# EAGLE schematic CPU (EAGLE 7.5.0), part 4 of 7
## Module MOV16
Ports: I1(in) I2(in) I3(in) I4(in) I5(in) I6(in) I8(in) I7(in) T1(in) T2(in) T3(in) T4(in) T5(in) T6(in) T7(in) T8(in) VCC(in) GND(in) SELECT_M_TO_ADDRESSBUS(out) SELECT_X_TO_ADDRESSBUS(out) SELECT_J_TO_ADDRESSBUS(out) SELECT_SP_TO_ADDRESSBUS(out) SELECT_BP_TO_ADDRESSBUS(out) SELECT_Y_TO_ADDRESSBUS(out) SELECT_Z_TO_ADDRESSBUS(out) LOAD_M_FROM_ADDRESSBUS(out) LOAD_X_FROM_ADDRESSBUS(out) LOAD_J_FROM_ADDRESSBUS(out) LOAD_SP_FROM_ADDRESSBUS(out) LOAD_BP_FROM_ADDRESSBUS(out) LOAD_Y_FROM_ADDRESSBUS(out) LOAD_Z_FROM_ADDRESSBUS(out)
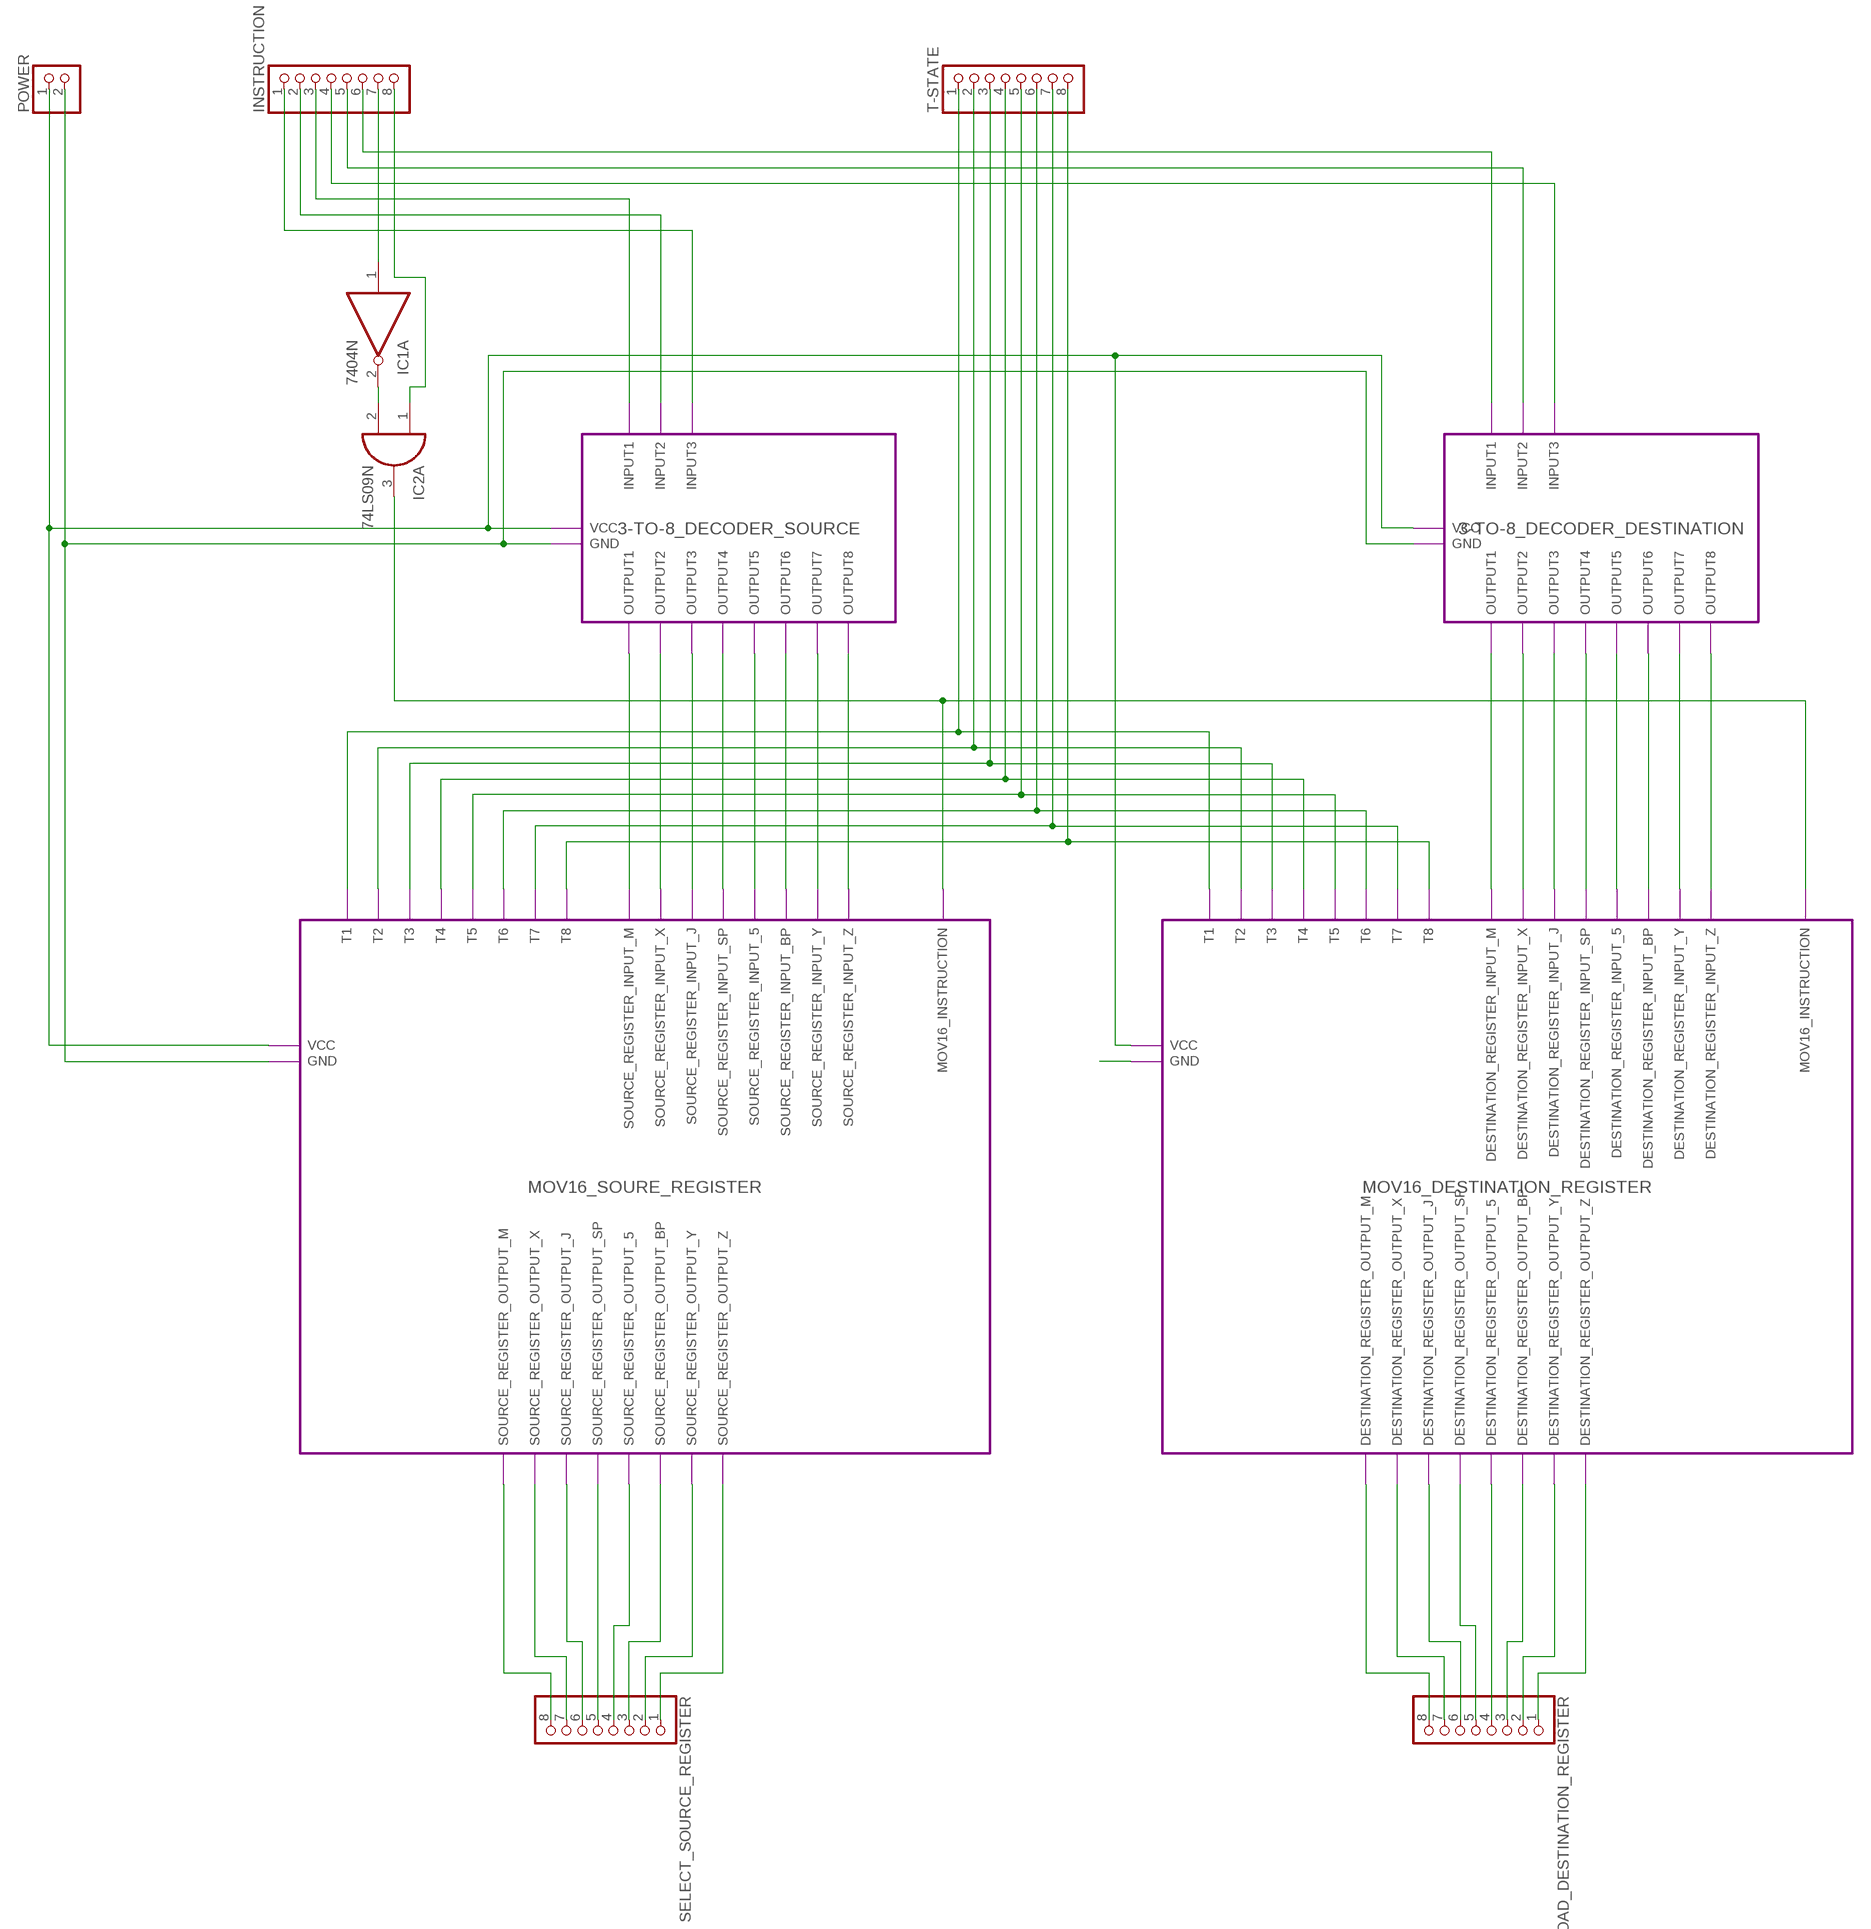
[diagram p58: schematic, module MOV16, sheet 1]

### Parts
IC1  7404N  [DIL14]
IC2  74LS09N  [DIL14]
INSTRUCTION  PINHD-1X8  [1X08]
LOAD_DESTINATION_REGISTER  PINHD-1X8  [1X08]
POWER  PINHD-1X2  [1X02]
SELECT_SOURCE_REGISTER  PINHD-1X8  [1X08]
T-STATE  PINHD-1X8  [1X08]

### Module instances
3-TO-8_DECODER_SOURCE = 3-TO-8_DECODER
3-TO-8_DECODER_DESTINATION = 3-TO-8_DECODER
MOV16_SOURE_REGISTER = MOV16_SOURE_REGISTER
MOV16_DESTINATION_REGISTER = MOV16_DESTINATION_REGISTER

### Nets
GND: POWER.2 ; port 3-TO-8_DECODER_SOURCE.GND 3-TO-8_DECODER_DESTINATION.GND MOV16_SOURE_REGISTER.GND
I1: INSTRUCTION.1 ; port 3-TO-8_DECODER_SOURCE.INPUT3
I2: INSTRUCTION.2 ; port 3-TO-8_DECODER_SOURCE.INPUT2
I3: INSTRUCTION.3 ; port 3-TO-8_DECODER_SOURCE.INPUT1
I4: INSTRUCTION.4 ; port 3-TO-8_DECODER_DESTINATION.INPUT3
I5: INSTRUCTION.5 ; port 3-TO-8_DECODER_DESTINATION.INPUT2
I6: INSTRUCTION.6 ; port 3-TO-8_DECODER_DESTINATION.INPUT1
I7: IC1.1(A:I) INSTRUCTION.7
I8: IC2.1(A:I0) INSTRUCTION.8
LOAD_5_FROM_ADDRESSBUS: LOAD_DESTINATION_REGISTER.4 ; port MOV16_DESTINATION_REGISTER.DESTINATION_REGISTER_OUTPUT_5
LOAD_BP_FROM_ADDRESSBUS: LOAD_DESTINATION_REGISTER.3 ; port MOV16_DESTINATION_REGISTER.DESTINATION_REGISTER_OUTPUT_BP
LOAD_J_FROM_ADDRESSBUS: LOAD_DESTINATION_REGISTER.6 ; port MOV16_DESTINATION_REGISTER.DESTINATION_REGISTER_OUTPUT_J
LOAD_M_FROM_ADDRESSBUS: LOAD_DESTINATION_REGISTER.8 ; port MOV16_DESTINATION_REGISTER.DESTINATION_REGISTER_OUTPUT_M
LOAD_SP_FROM_ADDRESSBUS: LOAD_DESTINATION_REGISTER.5 ; port MOV16_DESTINATION_REGISTER.DESTINATION_REGISTER_OUTPUT_SP
LOAD_X_FROM_ADDRESSBUS: LOAD_DESTINATION_REGISTER.7 ; port MOV16_DESTINATION_REGISTER.DESTINATION_REGISTER_OUTPUT_X
LOAD_Y_FROM_ADDRESSBUS: LOAD_DESTINATION_REGISTER.2 ; port MOV16_DESTINATION_REGISTER.DESTINATION_REGISTER_OUTPUT_Y
LOAD_Z_FROM_ADDRESSBUS: LOAD_DESTINATION_REGISTER.1 ; port MOV16_DESTINATION_REGISTER.DESTINATION_REGISTER_OUTPUT_Z
N$3: IC1.2(A:O) IC2.2(A:I1)
N$6: port MOV16_DESTINATION_REGISTER.GND
N$10: IC2.3(A:O) ; port MOV16_DESTINATION_REGISTER.MOV16_INSTRUCTION MOV16_SOURE_REGISTER.MOV16_INSTRUCTION
N$11: port 3-TO-8_DECODER_SOURCE.OUTPUT1 MOV16_SOURE_REGISTER.SOURCE_REGISTER_INPUT_M
N$12: port MOV16_SOURE_REGISTER.SOURCE_REGISTER_INPUT_X 3-TO-8_DECODER_SOURCE.OUTPUT2
N$13: port 3-TO-8_DECODER_SOURCE.OUTPUT3 MOV16_SOURE_REGISTER.SOURCE_REGISTER_INPUT_J
N$14: port MOV16_SOURE_REGISTER.SOURCE_REGISTER_INPUT_SP 3-TO-8_DECODER_SOURCE.OUTPUT4
N$15: port 3-TO-8_DECODER_SOURCE.OUTPUT5 MOV16_SOURE_REGISTER.SOURCE_REGISTER_INPUT_5
N$16: port MOV16_SOURE_REGISTER.SOURCE_REGISTER_INPUT_BP 3-TO-8_DECODER_SOURCE.OUTPUT6
N$17: port 3-TO-8_DECODER_SOURCE.OUTPUT7 MOV16_SOURE_REGISTER.SOURCE_REGISTER_INPUT_Y
N$18: port MOV16_SOURE_REGISTER.SOURCE_REGISTER_INPUT_Z 3-TO-8_DECODER_SOURCE.OUTPUT8
N$19: port MOV16_DESTINATION_REGISTER.DESTINATION_REGISTER_INPUT_M 3-TO-8_DECODER_DESTINATION.OUTPUT1
N$20: port 3-TO-8_DECODER_DESTINATION.OUTPUT2 MOV16_DESTINATION_REGISTER.DESTINATION_REGISTER_INPUT_X
N$21: port MOV16_DESTINATION_REGISTER.DESTINATION_REGISTER_INPUT_J 3-TO-8_DECODER_DESTINATION.OUTPUT3
N$22: port 3-TO-8_DECODER_DESTINATION.OUTPUT4 MOV16_DESTINATION_REGISTER.DESTINATION_REGISTER_INPUT_SP
N$23: port MOV16_DESTINATION_REGISTER.DESTINATION_REGISTER_INPUT_5 3-TO-8_DECODER_DESTINATION.OUTPUT5
N$24: port 3-TO-8_DECODER_DESTINATION.OUTPUT6 MOV16_DESTINATION_REGISTER.DESTINATION_REGISTER_INPUT_BP
N$25: port MOV16_DESTINATION_REGISTER.DESTINATION_REGISTER_INPUT_Y 3-TO-8_DECODER_DESTINATION.OUTPUT7
N$26: port 3-TO-8_DECODER_DESTINATION.OUTPUT8 MOV16_DESTINATION_REGISTER.DESTINATION_REGISTER_INPUT_Z
SELECT_5_TO_ADDRESSBUS: SELECT_SOURCE_REGISTER.4 ; port MOV16_SOURE_REGISTER.SOURCE_REGISTER_OUTPUT_5
SELECT_BP_TO_ADDRESSBUS: SELECT_SOURCE_REGISTER.3 ; port MOV16_SOURE_REGISTER.SOURCE_REGISTER_OUTPUT_BP
SELECT_J_TO_ADDRESSBUS: SELECT_SOURCE_REGISTER.6 ; port MOV16_SOURE_REGISTER.SOURCE_REGISTER_OUTPUT_J
SELECT_M_TO_ADDRESSBUS: SELECT_SOURCE_REGISTER.8 ; port MOV16_SOURE_REGISTER.SOURCE_REGISTER_OUTPUT_M
SELECT_SP_TO_ADDRESSBUS: SELECT_SOURCE_REGISTER.5 ; port MOV16_SOURE_REGISTER.SOURCE_REGISTER_OUTPUT_SP
SELECT_X_TO_ADDRESSBUS: SELECT_SOURCE_REGISTER.7 ; port MOV16_SOURE_REGISTER.SOURCE_REGISTER_OUTPUT_X
SELECT_Y_TO_ADDRESSBUS: SELECT_SOURCE_REGISTER.2 ; port MOV16_SOURE_REGISTER.SOURCE_REGISTER_OUTPUT_Y
SELECT_Z_TO_ADDRESSBUS: SELECT_SOURCE_REGISTER.1 ; port MOV16_SOURE_REGISTER.SOURCE_REGISTER_OUTPUT_Z
T1: T-STATE.1 ; port MOV16_DESTINATION_REGISTER.T1 MOV16_SOURE_REGISTER.T1
T2: T-STATE.2 ; port MOV16_SOURE_REGISTER.T2 MOV16_DESTINATION_REGISTER.T2
T3: T-STATE.3 ; port MOV16_SOURE_REGISTER.T3 MOV16_DESTINATION_REGISTER.T3
T4: T-STATE.4 ; port MOV16_SOURE_REGISTER.T4 MOV16_DESTINATION_REGISTER.T4
T5: T-STATE.5 ; port MOV16_SOURE_REGISTER.T5 MOV16_DESTINATION_REGISTER.T5
T6: T-STATE.6 ; port MOV16_SOURE_REGISTER.T6 MOV16_DESTINATION_REGISTER.T6
T7: T-STATE.7 ; port MOV16_SOURE_REGISTER.T7 MOV16_DESTINATION_REGISTER.T7
T8: T-STATE.8 ; port MOV16_DESTINATION_REGISTER.T8 MOV16_SOURE_REGISTER.T8
VCC: POWER.1 ; port 3-TO-8_DECODER_SOURCE.VCC 3-TO-8_DECODER_DESTINATION.VCC MOV16_SOURE_REGISTER.VCC MOV16_DESTINATION_REGISTER.VCC
Unconnected: IC1.3(B:I) IC1.4(B:O) IC1.5(C:I) IC1.6(C:O) IC1.8(D:O) IC1.9(D:I) IC1.10(E:O) IC1.11(E:I) IC1.12(F:O) IC1.13(F:I) IC2.4(B:I0) IC2.5(B:I1) IC2.6(B:O) IC2.8(C:O) IC2.9(C:I0) IC2.10(C:I1) IC2.11(D:O) IC2.12(D:I0) IC2.13(D:I1)

### Power pins joined to a net without a drawn wire
GND: IC1.7(P:GND) IC2.7(P:GND)
VCC: IC1.14(P:VCC) IC2.14(P:VCC)

### Library data of the parts
IC1 = 74xx-eu:74*04: Hex INVERTER
IC2 = 74xx-eu:74*09: Quad 2-input AND gate, open collector
INSTRUCTION LOAD_DESTINATION_REGISTER SELECT_SOURCE_REGISTER T-STATE = pinhead:PINHD-1X8: PIN HEADER
POWER = pinhead:PINHD-1X2: PIN HEADER

## Module JMP
Ports: I1(in) I2(in) I3(in) I4(in) I5(in) I6(in) I7(in) I8(in) T1(in) T2(in) T3(in) T4(in) T5(in) T6(in) T7(in) T8(in) VCC(in) GND(in) SELECT_J_TO_ADDRESSBUS(out) LOAD_PC(out)
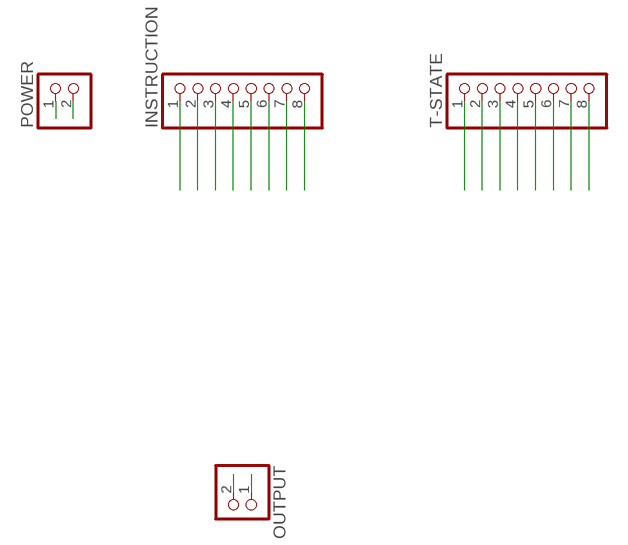
[diagram p59: schematic, module JMP, sheet 1]

### Parts
INSTRUCTION  PINHD-1X8  [1X08]
OUTPUT  PINHD-1X2  [1X02]
POWER  PINHD-1X2  [1X02]
T-STATE  PINHD-1X8  [1X08]

### Nets
GND: POWER.2
I1: INSTRUCTION.1
I2: INSTRUCTION.2
I3: INSTRUCTION.3
I4: INSTRUCTION.4
I5: INSTRUCTION.5
I6: INSTRUCTION.6
I7: INSTRUCTION.7
I8: INSTRUCTION.8
LOAD_PC: OUTPUT.2
SELECT_J_TO_ADDRESSBUS: OUTPUT.1
T1: T-STATE.1
T2: T-STATE.2
T3: T-STATE.3
T4: T-STATE.4
T5: T-STATE.5
T6: T-STATE.6
T7: T-STATE.7
T8: T-STATE.8
VCC: POWER.1

### Library data of the parts
INSTRUCTION T-STATE = pinhead:PINHD-1X8: PIN HEADER
OUTPUT POWER = pinhead:PINHD-1X2: PIN HEADER

## Module MOV
Ports: I1(in) I2(in) I3(in) I4(in) I5(in) I6(in) I7(in) I8(in) T1(in) T2(in) T3(in) T4(in) T5(in) T6(in) T7(in) T8(in) VCC(in) GND(in) SELECT_D_TO_DATABUS(out) SELECT_E_TO_DATABUS(out) SELECT_F_TO_DATABUS(out) SELECT_G_TO_DATABUS(out) SELECT_H_TO_DATABUS(out) SELECT_XL_TO_DATABUS(out) SELECT_XH_TO_DATABUS(out) SELECT_XE_TO_DATABUS(out) LOAD_D_FROM_DATABUS(out) LOAD_E_FROM_DATABUS(out) LOAD_F_FROM_DATABUS(out) LOAD_G_FROM_DATABUS(out) LOAD_H_FROM_DATABUS(out) LOAD_XL_FROM_DATABUS(out) LOAD_XH_FROM_DATABUS(out) LOAD_XE_FROM_DATABUS(out)
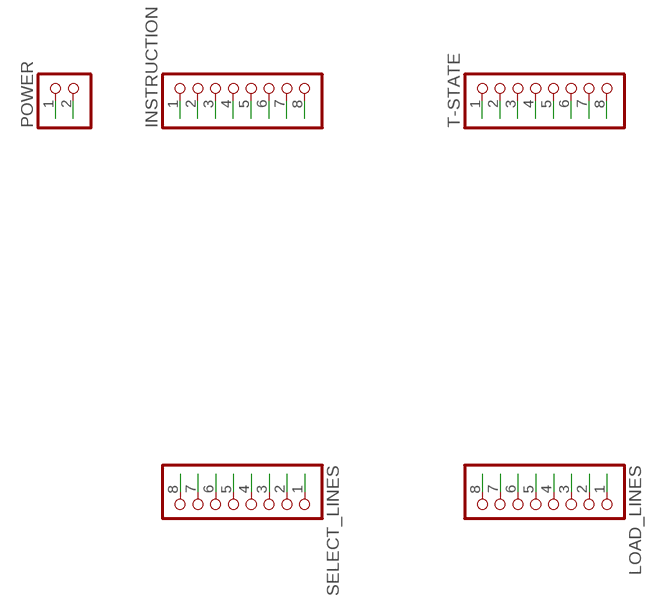
[diagram p60: schematic, module MOV, sheet 1]

### Parts
INSTRUCTION  PINHD-1X8  [1X08]
LOAD_LINES  PINHD-1X8  [1X08]
POWER  PINHD-1X2  [1X02]
SELECT_LINES  PINHD-1X8  [1X08]
T-STATE  PINHD-1X8  [1X08]

### Nets
GND: POWER.2
I1: INSTRUCTION.1
I2: INSTRUCTION.2
I3: INSTRUCTION.3
I4: INSTRUCTION.4
I5: INSTRUCTION.5
I6: INSTRUCTION.6
I7: INSTRUCTION.7
I8: INSTRUCTION.8
LOAD_D_FROM_DATABUS: LOAD_LINES.8
LOAD_E_FROM_DATABUS: LOAD_LINES.7
LOAD_F_FROM_DATABUS: LOAD_LINES.6
LOAD_G_FROM_DATABUS: LOAD_LINES.5
LOAD_H_FROM_DATABUS: LOAD_LINES.4
LOAD_XE_FROM_DATABUS: LOAD_LINES.1
LOAD_XH_FROM_DATABUS: LOAD_LINES.2
LOAD_XL_FROM_DATABUS: LOAD_LINES.3
SELECT_D_TO_DATABUS: SELECT_LINES.8
SELECT_E_TO_DATABUS: SELECT_LINES.7
SELECT_F_TO_DATABUS: SELECT_LINES.6
SELECT_G_TO_DATABUS: SELECT_LINES.5
SELECT_H_TO_DATABUS: SELECT_LINES.4
SELECT_XE_TO_DATABUS: SELECT_LINES.1
SELECT_XH_TO_DATABUS: SELECT_LINES.2
SELECT_XL_TO_DATABUS: SELECT_LINES.3
T1: T-STATE.1
T2: T-STATE.2
T3: T-STATE.3
T4: T-STATE.4
T5: T-STATE.5
T6: T-STATE.6
T7: T-STATE.7
T8: T-STATE.8
VCC: POWER.1

### Library data of the parts
INSTRUCTION LOAD_LINES SELECT_LINES T-STATE = pinhead:PINHD-1X8: PIN HEADER
POWER = pinhead:PINHD-1X2: PIN HEADER

## Module JZ
Ports: I1(in) I2(in) I3(in) I4(in) I5(in) I6(in) I7(in) I8(in) T1(in) T2(in) T3(in) T4(in) T5(in) T6(in) T7(in) T8(in) ZERO(in) VCC(in) GND(in) SELECT_FLAGS(out) SELECT_J_TO_ADDRESSBUS(out) LOAD_PC(out)
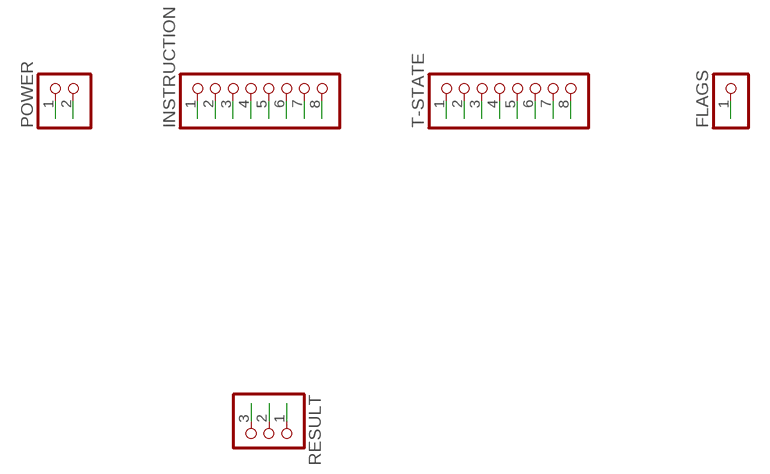
[diagram p61: schematic, module JZ, sheet 1]

### Parts
FLAGS  PINHD-1X1  [1X01]
INSTRUCTION  PINHD-1X8  [1X08]
POWER  PINHD-1X2  [1X02]
RESULT  PINHD-1X3  [1X03]
T-STATE  PINHD-1X8  [1X08]

### Nets
GND: POWER.2
I1: INSTRUCTION.1
I2: INSTRUCTION.2
I3: INSTRUCTION.3
I4: INSTRUCTION.4
I5: INSTRUCTION.5
I6: INSTRUCTION.6
I7: INSTRUCTION.7
I8: INSTRUCTION.8
LOAD_PC: RESULT.3
SELECT_FLAGS: RESULT.1
SELECT_J_TO_ADDRESSBUS: RESULT.2
T1: T-STATE.1
T2: T-STATE.2
T3: T-STATE.3
T4: T-STATE.4
T5: T-STATE.5
T6: T-STATE.6
T7: T-STATE.7
T8: T-STATE.8
VCC: POWER.1
ZERO: FLAGS.1

### Library data of the parts
FLAGS = pinhead:PINHD-1X1: PIN HEADER
INSTRUCTION T-STATE = pinhead:PINHD-1X8: PIN HEADER
POWER = pinhead:PINHD-1X2: PIN HEADER
RESULT = pinhead:PINHD-1X3: PIN HEADER

## Module JNS
Ports: I1(in) I2(in) I3(in) I4(in) I5(in) I6(in) I7(in) I8(in) T1(in) T2(in) T3(in) T4(in) T5(in) T6(in) T7(in) T8(in) SIGN(in) VCC(in) GND(in) SELECT_FLAGS(out) LOAD_PC(out) SELECT_J_TO_ADDRESSBUS(out)
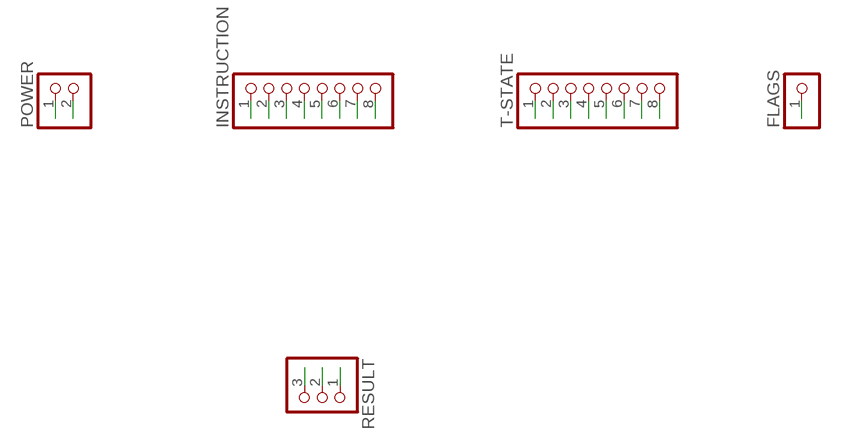
[diagram p62: schematic, module JNS, sheet 1]

### Parts
FLAGS  PINHD-1X1  [1X01]
INSTRUCTION  PINHD-1X8  [1X08]
POWER  PINHD-1X2  [1X02]
RESULT  PINHD-1X3  [1X03]
T-STATE  PINHD-1X8  [1X08]

### Nets
GND: POWER.2
I1: INSTRUCTION.1
I2: INSTRUCTION.2
I3: INSTRUCTION.3
I4: INSTRUCTION.4
I5: INSTRUCTION.5
I6: INSTRUCTION.6
I7: INSTRUCTION.7
I8: INSTRUCTION.8
LOAD_PC: RESULT.3
SELECT_FLAGS: RESULT.1
SELECT_J_TO_ADDRESSBUS: RESULT.2
SIGN: FLAGS.1
T1: T-STATE.1
T2: T-STATE.2
T3: T-STATE.3
T4: T-STATE.4
T5: T-STATE.5
T6: T-STATE.6
T7: T-STATE.7
T8: T-STATE.8
VCC: POWER.1

### Library data of the parts
FLAGS = pinhead:PINHD-1X1: PIN HEADER
INSTRUCTION T-STATE = pinhead:PINHD-1X8: PIN HEADER
POWER = pinhead:PINHD-1X2: PIN HEADER
RESULT = pinhead:PINHD-1X3: PIN HEADER

## Module JNC
Ports: I1(in) I2(in) I3(in) I4(in) I5(in) I6(in) I7(in) I8(in) T1(in) T2(in) T3(in) T4(in) T5(in) T6(in) T7(in) T8(in) VCC(in) GND(in) SELECT_FLAGS(out) LOAD_PC(out) SELECT_J_TO_ADDRESSBUS(out) CARRY(in)
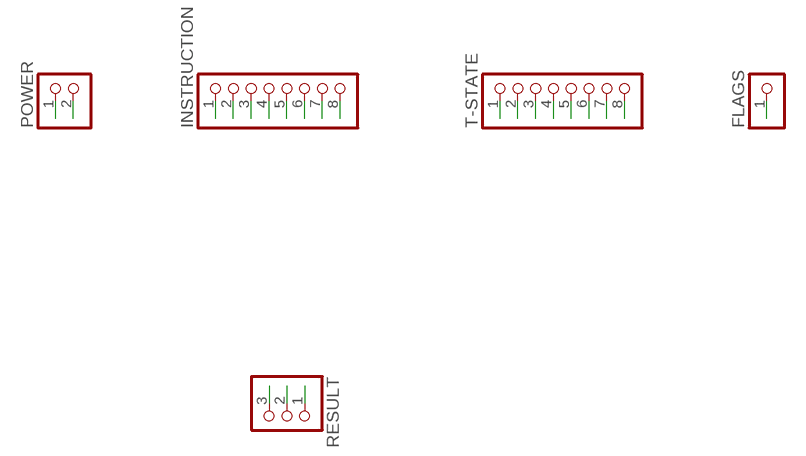
[diagram p63: schematic, module JNC, sheet 1]

### Parts
FLAGS  PINHD-1X1  [1X01]
INSTRUCTION  PINHD-1X8  [1X08]
POWER  PINHD-1X2  [1X02]
RESULT  PINHD-1X3  [1X03]
T-STATE  PINHD-1X8  [1X08]

### Nets
CARRY: FLAGS.1
GND: POWER.2
I1: INSTRUCTION.1
I2: INSTRUCTION.2
I3: INSTRUCTION.3
I4: INSTRUCTION.4
I5: INSTRUCTION.5
I6: INSTRUCTION.6
I7: INSTRUCTION.7
I8: INSTRUCTION.8
LOAD_PC: RESULT.3
SELECT_FLAGS: RESULT.1
SELECT_J_TO_ADDRESSBUS: RESULT.2
T1: T-STATE.1
T2: T-STATE.2
T3: T-STATE.3
T4: T-STATE.4
T5: T-STATE.5
T6: T-STATE.6
T7: T-STATE.7
T8: T-STATE.8
VCC: POWER.1

### Library data of the parts
FLAGS = pinhead:PINHD-1X1: PIN HEADER
INSTRUCTION T-STATE = pinhead:PINHD-1X8: PIN HEADER
POWER = pinhead:PINHD-1X2: PIN HEADER
RESULT = pinhead:PINHD-1X3: PIN HEADER

## Module JNZ
Ports: I1(in) I2(in) I3(in) I4(in) I5(in) I6(in) I7(in) I8(in) T1(in) T2(in) T3(in) T4(in) T5(in) T6(in) T7(in) T8(in) ZERO(in) VCC(in) GND(in) SELECT_FLAGS(out) LOAD_PC(out) SELECT_J_TO_ADDRESSBUS(out)
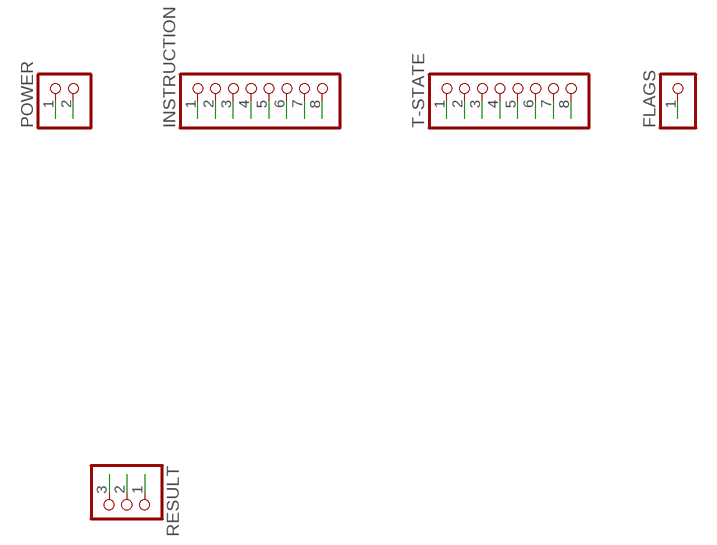
[diagram p64: schematic, module JNZ, sheet 1]

### Parts
FLAGS  PINHD-1X1  [1X01]
INSTRUCTION  PINHD-1X8  [1X08]
POWER  PINHD-1X2  [1X02]
RESULT  PINHD-1X3  [1X03]
T-STATE  PINHD-1X8  [1X08]

### Nets
GND: POWER.2
I1: INSTRUCTION.1
I2: INSTRUCTION.2
I3: INSTRUCTION.3
I4: INSTRUCTION.4
I5: INSTRUCTION.5
I6: INSTRUCTION.6
I7: INSTRUCTION.7
I8: INSTRUCTION.8
LOAD_PC: RESULT.3
SELECT_FLAGS: RESULT.1
SELECT_J_TO_ADDRESSBUS: RESULT.2
T1: T-STATE.1
T2: T-STATE.2
T3: T-STATE.3
T4: T-STATE.4
T5: T-STATE.5
T6: T-STATE.6
T7: T-STATE.7
T8: T-STATE.8
VCC: POWER.1
ZERO: FLAGS.1

### Library data of the parts
FLAGS = pinhead:PINHD-1X1: PIN HEADER
INSTRUCTION T-STATE = pinhead:PINHD-1X8: PIN HEADER
POWER = pinhead:PINHD-1X2: PIN HEADER
RESULT = pinhead:PINHD-1X3: PIN HEADER

## Module ADDER_16BIT
Ports: I1(in) I2(in) I3(in) I4(in) I5(in) I6(in) I7(in) I8(in) T1(in) T2(in) T3(in) T4(in) T5(in) T6(in) T7(in) T8(in) VCC(in) GND(in) SELECT_X_TO_ADDRESSBUS(out) LOAD_INPUT_A(out) SELECT_J_TO_ADDRESSBUS(out) LOAD_INPUT_B(out) SELECT_INPUT_A(out) SELECT_INPUT_B(out) LOAD_OUTPUT_C(out) SELECT_OUTPUT_C(out) LOAD_X_FROM_ADDRESSBUS(out)
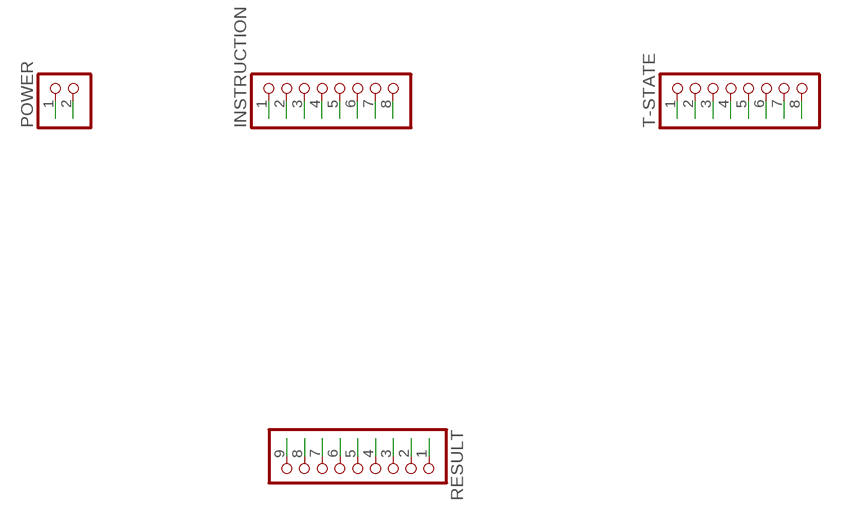
[diagram p65: schematic, module ADDER_16BIT, sheet 1]

### Parts
INSTRUCTION  PINHD-1X8  [1X08]
POWER  PINHD-1X2  [1X02]
RESULT  PINHD-1X9  [1X09]
T-STATE  PINHD-1X8  [1X08]

### Nets
GND: POWER.2
I1: INSTRUCTION.1
I2: INSTRUCTION.2
I3: INSTRUCTION.3
I4: INSTRUCTION.4
I5: INSTRUCTION.5
I6: INSTRUCTION.6
I7: INSTRUCTION.7
I8: INSTRUCTION.8
LOAD_INPUT_A: RESULT.2
LOAD_INPUT_B: RESULT.4
LOAD_OUTPUT_C: RESULT.7
LOAD_X_FROM_ADDRESSBUS: RESULT.9
SELECT_INPUT_A: RESULT.5
SELECT_INPUT_B: RESULT.6
SELECT_J_TO_ADDRESSBUS: RESULT.3
SELECT_OUTPUT_C: RESULT.8
SELECT_X_TO_ADDRESSBUS: RESULT.1
T1: T-STATE.1
T2: T-STATE.2
T3: T-STATE.3
T4: T-STATE.4
T5: T-STATE.5
T6: T-STATE.6
T7: T-STATE.7
T8: T-STATE.8
VCC: POWER.1

### Library data of the parts
INSTRUCTION T-STATE = pinhead:PINHD-1X8: PIN HEADER
POWER = pinhead:PINHD-1X2: PIN HEADER
RESULT = pinhead:PINHD-1X9: PIN HEADER

## Module IN
Ports: I1(in) I2(in) I3(in) I4(in) I5(in) I6(in) I7(in) I8(in) T1(in) T2(in) T3(in) T4(in) T5(in) T6(in) T7(in) T8(in) VCC(in) GND(in) SELECT_PORT_A_TO_DATABUS(out) SELECT_PORT_B_TO_DATABUS(out) LOAD_XL_FROM_DATABUS(out)
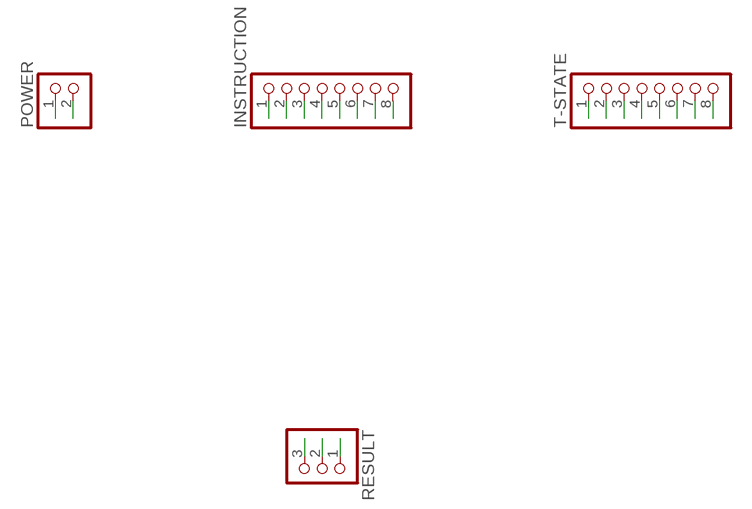
[diagram p66: schematic, module IN, sheet 1]

### Parts
INSTRUCTION  PINHD-1X8  [1X08]
POWER  PINHD-1X2  [1X02]
RESULT  PINHD-1X3  [1X03]
T-STATE  PINHD-1X8  [1X08]

### Nets
GND: POWER.2
I1: INSTRUCTION.1
I2: INSTRUCTION.2
I3: INSTRUCTION.3
I4: INSTRUCTION.4
I5: INSTRUCTION.5
I6: INSTRUCTION.6
I7: INSTRUCTION.7
I8: INSTRUCTION.8
LOAD_XL_FROM_DATABUS: RESULT.3
SELECT_PORT_A_TO_DATABUS: RESULT.1
SELECT_PORT_B_TO_DATABUS: RESULT.2
T1: T-STATE.1
T2: T-STATE.2
T3: T-STATE.3
T4: T-STATE.4
T5: T-STATE.5
T6: T-STATE.6
T7: T-STATE.7
T8: T-STATE.8
VCC: POWER.1

### Library data of the parts
INSTRUCTION T-STATE = pinhead:PINHD-1X8: PIN HEADER
POWER = pinhead:PINHD-1X2: PIN HEADER
RESULT = pinhead:PINHD-1X3: PIN HEADER

## Module OUT
Ports: I1(in) I2(in) I3(in) I4(in) I5(in) I6(in) I8(in) I7(in) T1(in) T2(in) T3(in) T4(in) T5(in) T6(in) T7(in) T8(in) VCC(in) GND(in) SELECT_XL_TO_DATABUS(out) LOAD_PORT_C_FROM_DATABUS(out) LOAD_PORT_D_FROM_DATABUS(out)
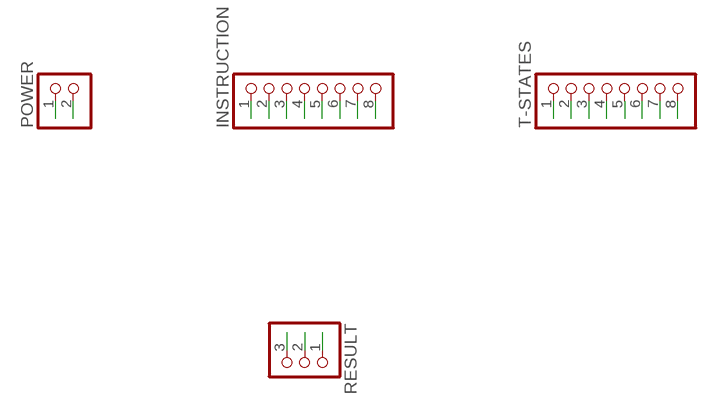
[diagram p67: schematic, module OUT, sheet 1]

### Parts
INSTRUCTION  PINHD-1X8  [1X08]
POWER  PINHD-1X2  [1X02]
RESULT  PINHD-1X3  [1X03]
T-STATES  PINHD-1X8  [1X08]

### Nets
GND: POWER.2
I1: INSTRUCTION.1
I2: INSTRUCTION.2
I3: INSTRUCTION.3
I4: INSTRUCTION.4
I5: INSTRUCTION.5
I6: INSTRUCTION.6
I7: INSTRUCTION.7
I8: INSTRUCTION.8
LOAD_PORT_C_FROM_DATABUS: RESULT.2
LOAD_PORT_D_FROM_DATABUS: RESULT.3
SELECT_XL_TO_DATABUS: RESULT.1
T1: T-STATES.1
T2: T-STATES.2
T3: T-STATES.3
T4: T-STATES.4
T5: T-STATES.5
T6: T-STATES.6
T7: T-STATES.7
T8: T-STATES.8
VCC: POWER.1

### Library data of the parts
INSTRUCTION T-STATES = pinhead:PINHD-1X8: PIN HEADER
POWER = pinhead:PINHD-1X2: PIN HEADER
RESULT = pinhead:PINHD-1X3: PIN HEADER

## Module SAVE_FLAGS
Ports: I1(in) I2(in) I3(in) I4(in) I5(in) I6(in) I7(in) I8(in) T1(in) T2(in) T3(in) T4(in) T5(in) T6(in) T7(in) T8(in) VCC(in) GND(in) SELECT_FLAGS(out) LOAD_FLAGSSAVED_FROM_FLAGSREGISTER(out)
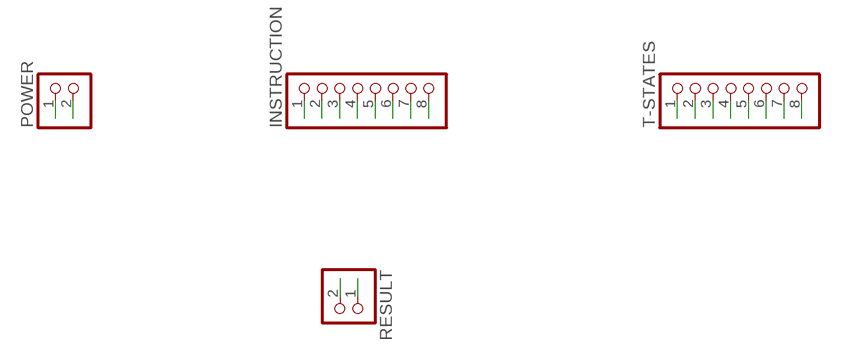
[diagram p68: schematic, module SAVE_FLAGS, sheet 1]

### Parts
INSTRUCTION  PINHD-1X8  [1X08]
POWER  PINHD-1X2  [1X02]
RESULT  PINHD-1X2  [1X02]
T-STATES  PINHD-1X8  [1X08]

### Nets
GND: POWER.2
I1: INSTRUCTION.1
I2: INSTRUCTION.2
I3: INSTRUCTION.3
I4: INSTRUCTION.4
I5: INSTRUCTION.5
I6: INSTRUCTION.6
I7: INSTRUCTION.7
I8: INSTRUCTION.8
LOAD_FLAGSSAVED_FROM_FLAGSREGISTER: RESULT.2
SELECT_FLAGS: RESULT.1
T1: T-STATES.1
T2: T-STATES.2
T3: T-STATES.3
T4: T-STATES.4
T5: T-STATES.5
T6: T-STATES.6
T7: T-STATES.7
T8: T-STATES.8
VCC: POWER.1

### Library data of the parts
INSTRUCTION T-STATES = pinhead:PINHD-1X8: PIN HEADER
POWER RESULT = pinhead:PINHD-1X2: PIN HEADER

## Module RESTORE_FLAGS
Ports: I1(in) I2(in) I3(in) I4(in) I5(in) I6(in) I7(in) I8(in) T1(in) T2(in) T3(in) T4(in) T5(in) T6(in) T7(in) T8(in) VCC(in) GND(in) LOAD_FLAGSSAVED_TO_FLAGSREGISTER(out) LOAD_FLAGS(out)
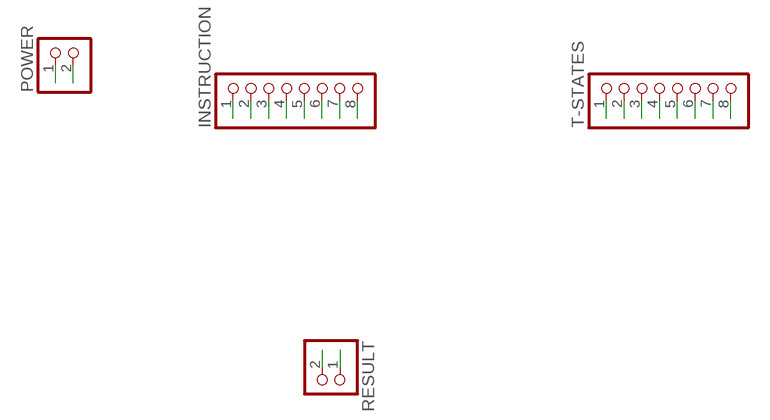
[diagram p69: schematic, module RESTORE_FLAGS, sheet 1]

### Parts
INSTRUCTION  PINHD-1X8  [1X08]
POWER  PINHD-1X2  [1X02]
RESULT  PINHD-1X2  [1X02]
T-STATES  PINHD-1X8  [1X08]

### Nets
GND: POWER.2
I1: INSTRUCTION.1
I2: INSTRUCTION.2
I3: INSTRUCTION.3
I4: INSTRUCTION.4
I5: INSTRUCTION.5
I6: INSTRUCTION.6
I7: INSTRUCTION.7
I8: INSTRUCTION.8
LOAD_FLAGS: RESULT.1
LOAD_FLAGSSAVED_TO_FLAGSREGISTER: RESULT.2
T1: T-STATES.1
T2: T-STATES.2
T3: T-STATES.3
T4: T-STATES.4
T5: T-STATES.5
T6: T-STATES.6
T7: T-STATES.7
T8: T-STATES.8
VCC: POWER.1

### Library data of the parts
INSTRUCTION T-STATES = pinhead:PINHD-1X8: PIN HEADER
POWER RESULT = pinhead:PINHD-1X2: PIN HEADER

## Module FLAGS_TO_OUTBUFFER
Ports: I1(in) I2(in) I3(in) I4(in) I5(in) I6(in) I7(in) I8(in) T1(in) T2(in) T3(in) T4(in) T5(in) T6(in) T7(in) T8(in) VCC(in) GND(in) LOAD_FLAGSFROMFLAGSBUS(out) SELECT_FLAGS_TO_OUTBUFFER(out)
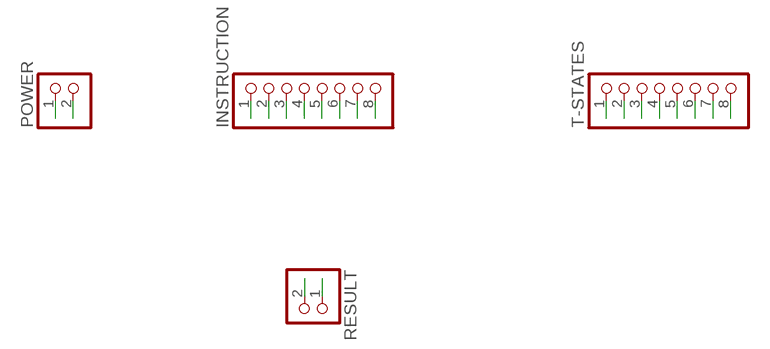
[diagram p70: schematic, module FLAGS_TO_OUTBUFFER, sheet 1]

### Parts
INSTRUCTION  PINHD-1X8  [1X08]
POWER  PINHD-1X2  [1X02]
RESULT  PINHD-1X2  [1X02]
T-STATES  PINHD-1X8  [1X08]

### Nets
GND: POWER.2
I1: INSTRUCTION.1
I2: INSTRUCTION.2
I3: INSTRUCTION.3
I4: INSTRUCTION.4
I5: INSTRUCTION.5
I6: INSTRUCTION.6
I7: INSTRUCTION.7
I8: INSTRUCTION.8
LOAD_FLAGSFROMFLAGSBUS: RESULT.2
SELECT_FLAGS_TO_OUTBUFFER: RESULT.1
T1: T-STATES.1
T2: T-STATES.2
T3: T-STATES.3
T4: T-STATES.4
T5: T-STATES.5
T6: T-STATES.6
T7: T-STATES.7
T8: T-STATES.8
VCC: POWER.1

### Library data of the parts
INSTRUCTION T-STATES = pinhead:PINHD-1X8: PIN HEADER
POWER RESULT = pinhead:PINHD-1X2: PIN HEADER

## Module INBUFFER_TO_FLAGS
Ports: I1(in) I2(in) I3(in) I4(in) I5(in) I6(in) I7(in) I8(in) T1(in) T2(in) T3(in) T4(in) T5(in) T6(in) T7(in) T8(in) VCC(in) GND(in) LOAD_FLAGS_INBUFFER_TO_FLAGS(out) SELECT_FLAGSTOFLAGSBUS(out)
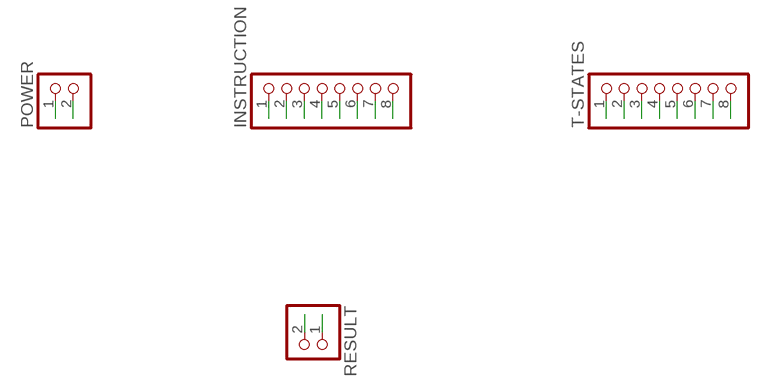
[diagram p71: schematic, module INBUFFER_TO_FLAGS, sheet 1]

### Parts
INSTRUCTION  PINHD-1X8  [1X08]
POWER  PINHD-1X2  [1X02]
RESULT  PINHD-1X2  [1X02]
T-STATES  PINHD-1X8  [1X08]

### Nets
GND: POWER.2
I1: INSTRUCTION.1
I2: INSTRUCTION.2
I3: INSTRUCTION.3
I4: INSTRUCTION.4
I5: INSTRUCTION.5
I6: INSTRUCTION.6
I7: INSTRUCTION.7
I8: INSTRUCTION.8
LOAD_FLAGS_INBUFFER_TO_FLAGS: RESULT.2
SELECT_FLAGSTOFLAGSBUS: RESULT.1
T1: T-STATES.1
T2: T-STATES.2
T3: T-STATES.3
T4: T-STATES.4
T5: T-STATES.5
T6: T-STATES.6
T7: T-STATES.7
T8: T-STATES.8
VCC: POWER.1

### Library data of the parts
INSTRUCTION T-STATES = pinhead:PINHD-1X8: PIN HEADER
POWER RESULT = pinhead:PINHD-1X2: PIN HEADER

## Module STORE_FLAGS_ON_STACK
Ports: I1(in) I2(in) I3(in) I4(in) I5(in) I6(in) I7(in) I8(in) T1(in) T2(in) T3(in) T4(in) T5(in) T6(in) T7(in) T8(in) VCC(in) GND(in) SELECT_M_TO_ADDRESSBUS(out) SELECT_FLAGSTODATABUS(out) LOAD_SRAM(out)
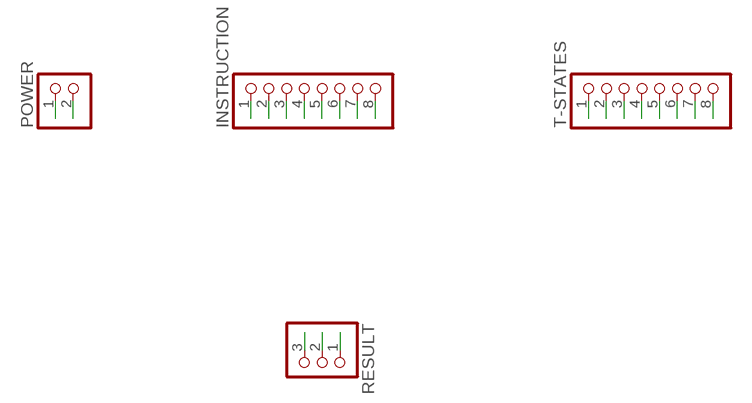
[diagram p72: schematic, module STORE_FLAGS_ON_STACK, sheet 1]

### Parts
INSTRUCTION  PINHD-1X8  [1X08]
POWER  PINHD-1X2  [1X02]
RESULT  PINHD-1X3  [1X03]
T-STATES  PINHD-1X8  [1X08]

### Nets
GND: POWER.2
I1: INSTRUCTION.1
I2: INSTRUCTION.2
I3: INSTRUCTION.3
I4: INSTRUCTION.4
I5: INSTRUCTION.5
I6: INSTRUCTION.6
I7: INSTRUCTION.7
I8: INSTRUCTION.8
LOAD_SRAM: RESULT.3
SELECT_FLAGSTODATABUS: RESULT.2
SELECT_M_TO_ADDRESSBUS: RESULT.1
T1: T-STATES.1
T2: T-STATES.2
T3: T-STATES.3
T4: T-STATES.4
T5: T-STATES.5
T6: T-STATES.6
T7: T-STATES.7
T8: T-STATES.8
VCC: POWER.1

### Library data of the parts
INSTRUCTION T-STATES = pinhead:PINHD-1X8: PIN HEADER
POWER = pinhead:PINHD-1X2: PIN HEADER
RESULT = pinhead:PINHD-1X3: PIN HEADER

## Module LOAD_FLAGS_FROM_STACK
Ports: I1(in) I2(in) I3(in) I4(in) I5(in) I6(in) I7(in) I8(in) T1(in) T2(in) T3(in) T4(in) T5(in) T6(in) T7(in) T8(in) VCC(in) GND(in) SELECT_M_TO_ADDRESSBUS(out) SELECT_SRAM(out) LOAD_FLAGS_FROM_DATABUS(out)
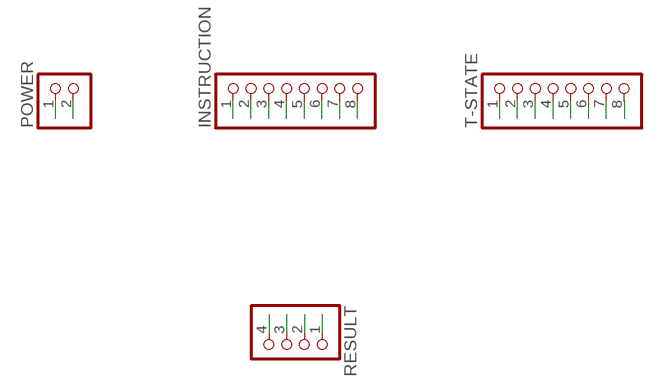
[diagram p73: schematic, module LOAD_FLAGS_FROM_STACK, sheet 1]

### Parts
INSTRUCTION  PINHD-1X8  [1X08]
POWER  PINHD-1X2  [1X02]
RESULT  PINHD-1X4  [1X04]
T-STATE  PINHD-1X8  [1X08]

### Nets
GND: POWER.2
I1: INSTRUCTION.1
I2: INSTRUCTION.2
I3: INSTRUCTION.3
I4: INSTRUCTION.4
I5: INSTRUCTION.5
I6: INSTRUCTION.6
I7: INSTRUCTION.7
I8: INSTRUCTION.8
LOAD_FLAGS_FROM_DATABUS: RESULT.4
RETURN_SRAM: RESULT.3
SELECT_M_TO_ADDRESSBUS: RESULT.1
SELECT_SRAM: RESULT.2
T1: T-STATE.1
T2: T-STATE.2
T3: T-STATE.3
T4: T-STATE.4
T5: T-STATE.5
T6: T-STATE.6
T7: T-STATE.7
T8: T-STATE.8
VCC: POWER.1

### Library data of the parts
INSTRUCTION T-STATE = pinhead:PINHD-1X8: PIN HEADER
POWER = pinhead:PINHD-1X2: PIN HEADER
RESULT = pinhead:PINHD-1X4: PIN HEADER